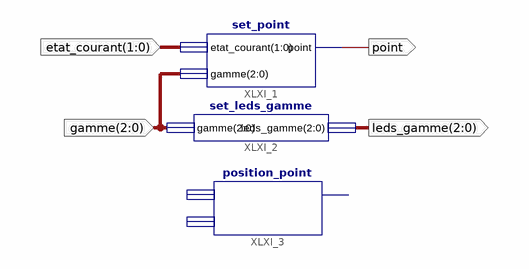
[diagram p0: schematic sheet 1]
// Xilinx ISE schematic afficheur_gamme_sch.sch (spartan3e) as structural Verilog: 3 symbols, 4 ports
module afficheur_gamme_sch (
  input  [2:0] gamme,
  input  [1:0] etat_courant,
  output point,
  output [2:0] leds_gamme
);

  set_point XLXI_1 (.etat_courant(etat_courant), .gamme(gamme), .point(point));
  set_leds_gamme XLXI_2 (.gamme(gamme), .leds_gamme(leds_gamme));
  position_point XLXI_3 ();  // open: etat_courant, pos_point, point
endmodule
